# Altium schematic sheet ArduinoNano.SchDoc
size A
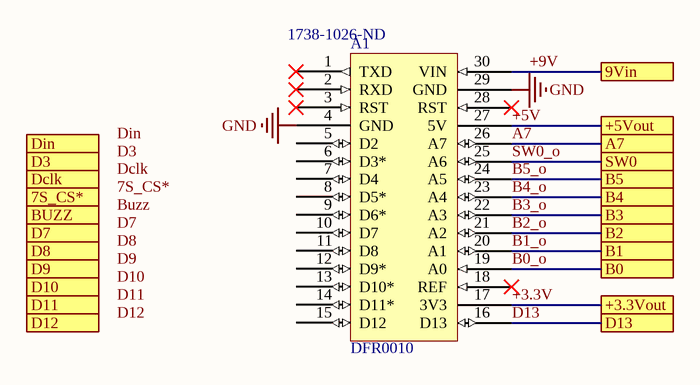
[diagram p0: ArduinoNano.SchDoc]

## Parts
A1  DFR0010  Supplier Part Number 1: 1738-1026-ND  [ArduinoNano]

## Ports
7S_CS*, 9Vin, +3.3Vout, +5Vout, A7, B0, B1, B2, B3, B4, B5, BUZZ, D3, D7, D8, D9, D10, D11, D12, D13, Dclk, Din, SW0

## Nets
GND: A1.4(GND) A1.29(GND)
+3.3V: A1.17(3V3) ; port +3.3Vout
+5V: A1.27(5V) ; port +5Vout
+9V: A1.30(VIN) ; port 9Vin
A7: A1.26(A7) ; port A7
B0_o: A1.19(A0) ; port B0
B1_o: A1.20(A1) ; port B1
B2_o: A1.21(A2) ; port B2
B3_o: A1.22(A3) ; port B3
B4_o: A1.23(A4) ; port B4
B5_o: A1.24(A5) ; port B5
D13: A1.16(D13) ; port D13
SW0_o: A1.25(A6) ; port SW0

Not connected (* = marked no-connect by the designer): A1 1(TXD)* 2(RXD)* 3(RST)* 5(D2) 6(D3*) 7(D4) 8(D5*) 9(D6*) 10(D7) 11(D8) 12(D9*) 13(D10*) 14(D11*) 15(D12) 18(REF)* 28(RST)*

## Notes on the sheet
- Labels drawn without touching a wire or pin: 7S_CS*, Buzz, D3, D7, D8, D9, D10, D11, D12, Dclk, Din

## Library data of the parts
A1 = ArduinoNano: DFRDUINO NANO V3.1 (ARDUINO NANO; ComponentLink1Description: 1738-1026-ND; ComponentLink1URL: https://www.digikey.com/product-detail/en/dfrobot/DFR0010/1738-1026-ND/6588448; Supplier 1: Digi-Key